# Altium schematic sheet Opamp.SchDoc
size A4; SheetNumber: 3; SheetTotal: 5
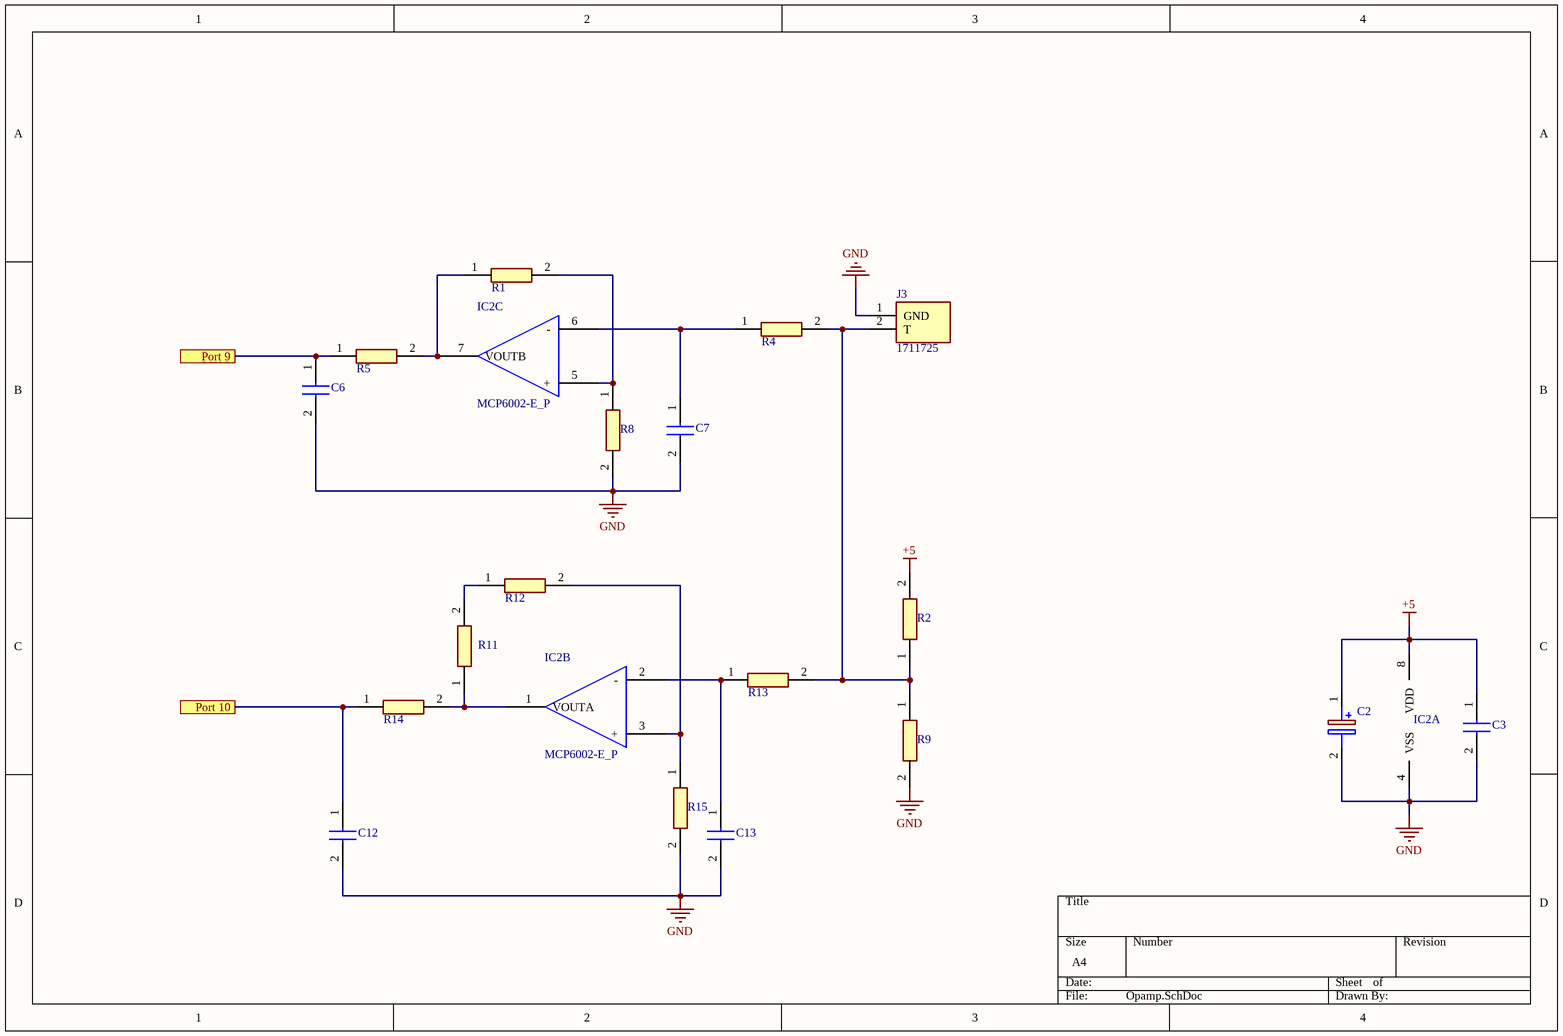
[diagram p0: Opamp.SchDoc]

## Parts
C2  EEU-FR1H100  [10µF 50V]  (value not drawn)
C3  C0805C104K5RAC7411  [100nF]  (value not drawn)
C6  C0805C103K5TACAUTO  [10nF]  (value not drawn)
C7  C0805C103K5TACAUTO  [10nF]  (value not drawn)
C12  C0805C103K5TACAUTO  [10nF]  (value not drawn)
C13  C0805C103K5TACAUTO  [10nF]  (value not drawn)
IC2  MCP6002-E_P  [DIP781W56P254L950H533Q8N]  (value not drawn)  (parts A,B,C of 3)
J3  1711725  [1711725]
R1  CRCW080510K0DHEAP  [Resistor]  (value not drawn)
R2  CR0805-JW-105ELF  [Resistor]  (value not drawn)
R4  CRCW08055K60FKTA  [Resistor]  (value not drawn)
R5  CRCW08055K60FKTA  [Resistor]  (value not drawn)
R8  CPF0805B18KE  [Resistor]  (value not drawn)
R9  CR0805-JW-105ELF  [Resistor]  (value not drawn)
R11  CRCW080510K0DHEAP  [Resistor]  (value not drawn)
R12  CRCW080510K0DHEAP  [Resistor]  (value not drawn)
R13  CRCW08055K60FKTA  [Resistor]  (value not drawn)
R14  CRCW08055K60FKTA  [Resistor]  (value not drawn)
R15  CPF0805B18KE  [Resistor]  (value not drawn)

## Ports
Port 9, Port 10

## Nets
+5: C2.1(+) C3.1 IC2.8(VDD) R2.2
GND: C2.2(-) C3.2 C6.2 C7.2 C12.2 C13.2 IC2.4(VSS) J3.1(GND) R8.2 R9.2 R15.2
Port 9: C6.1 R5.1 ; port Port 9
Port 10: C12.1 R14.1 ; port Port 10
NetC7_1: C7.1 IC2.6(-) R4.1
NetC13_1: C13.1 IC2.2(-) R13.1
NetIC2_1: IC2.1(VOUTA) R11.1 R14.2
NetIC2_3: IC2.3(+) R12.2 R15.1
NetIC2_5: IC2.5(+) R1.2 R8.1
NetIC2_7: IC2.7(VOUTB) R1.1 R5.2
NetJ3_2: J3.2(T) R2.1 R4.2 R9.1 R13.2
NetR11_2: R11.2 R12.1

## Library data of the parts
C2 = EEU-FR1H100: Capacitor Polarised 50VDC 10uF; Manufacturer_Name: Panasonic; Datasheet Link: https://componentsearchengine.com//EEU-FR1H100.pdf; Height: 12.5mm; Mouser2 Part Number: 667-EEU-FR1H100; Mouser2 Price/Stock: https://www.mouser.com/Search/Refine.aspx?Keyword=667-EEU-FR1H100; Manufacturer_Part_Number: EEU-FR1H100
C3 = C0805C104K5RAC7411: Capacitor  0.1 uF 50VDC; Manufacturer_Name: Kemet; Datasheet Link: https://componentsearchengine.com//C0805C104K5RAC7411.pdf; Height: 0.88mm; Mouser2 Part Number: 80-C0805C104K5RACLR; Mouser2 Price/Stock: https://www.mouser.com/Search/Refine.aspx?Keyword=80-C0805C104K5RACLR; Manufacturer_Part_Number: C0805C104K5RAC7411
C6 C7 C12 C13 = C0805C103K5TACAUTO: Capacitor 0.01µF 50VDC; Manufacturer_Name: Kemet; Height: 0.88mm; Manufacturer_Part_Number: C0805C103K5TACAUTO
IC2 = MCP6002-E_P: Integrated Circuit, opamp; Manufacturer_Name: Microchip; Manufacturer_Part_Number: MCP6002-E/P; Datasheet Link: https://componentsearchengine.com//MCP6002-E_P.pdf; Height: 5.334mm; Mouser2 Part Number: 579-MCP6002-E/P; Mouser2 Price/Stock: https://www.mouser.com/Search/Refine.aspx?Keyword=579-MCP6002-E%2FP
J3 = 1711725: Connector; Manufacturer_Name: Phoenix Contact; Datasheet Link: http://www.phoenixcontact.com/de/produkte/1711725/pdf; Height: 18.2mm; Manufacturer_Part_Number: 1711725
R1 R11 R12 = CRCW080510K0DHEAP: Resistor 10KOhm; Manufacturer_Name: Vishay; Datasheet Link: https://www.arrow.com/en/products/crcw080510k0dheap/vishay; Height: 0.5mm; Manufacturer_Part_Number: CRCW080510K0DHEAP
R2 R9 = CR0805-JW-105ELF: Resistor 1MOhm; Manufacturer_Name: Bourns; Datasheet Link: https://www.bourns.com/pdfs/chpreztr.pdf; Height: 0.6mm; Manufacturer_Part_Number: CR0805-JW-105ELF
R4 R5 R13 R14 = CRCW08055K60FKTA: Resistor 5.6KOhm; Manufacturer_Name: Vishay; Datasheet Link: http://www.vishay.com/docs/20035/dcrcwe3.pdf; Height: 0.5mm; Manufacturer_Part_Number: CRCW08055K60FKTA
R8 R15 = CPF0805B18KE: Resistor 510Ohm; Manufacturer_Name: TE Connectivity; Datasheet Link: https://datasheet.datasheetarchive.com/originals/distributors/DKDS-21/401696.pdf; Height: 0.65mm; Manufacturer_Part_Number: CPF0805B18KE